# EAGLE design USB to TTL (EAGLE 9.6.2)
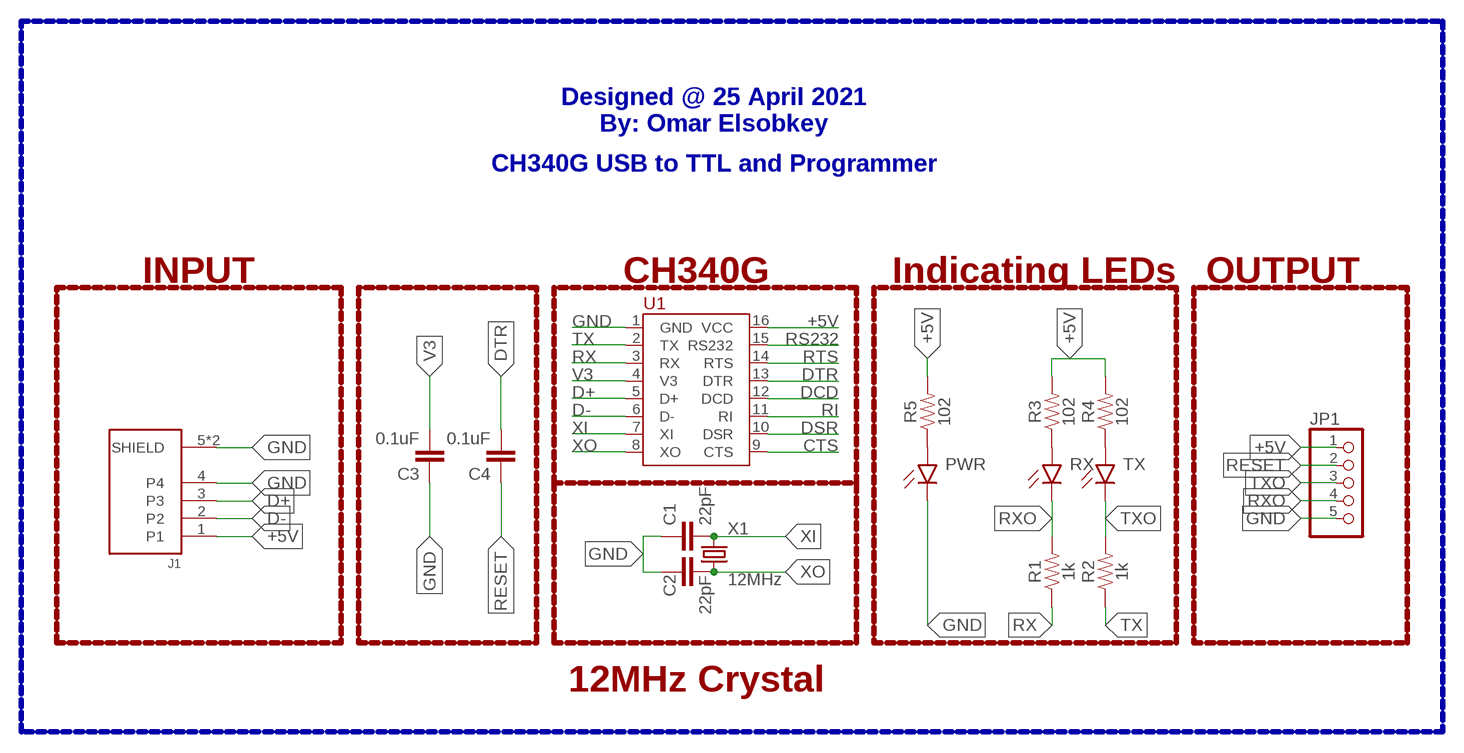
[diagram p0: schematic, sheet 1]

## Parts
C1  22pF  22PF-PTH-2.54MM-200V-5%  [CAP-PTH-2.54]
C2  22pF  22PF-PTH-2.54MM-200V-5%  [CAP-PTH-2.54]
C3  0.1uF  0.1UF-KIT-EZ-50V-20%  [CAP-PTH-SMALL-KIT]
C4  0.1uF  0.1UF-KIT-EZ-50V-20%  [CAP-PTH-SMALL-KIT]
J1  0480371000  [0480371000]
JP1  PINHD-1X5/90  [1X05/90]
PWR  CHIP-FLAT-B_0805  [LEDC2012X110N_FLAT-B]
R1  1k  RESISTOR1206  [1206]
R2  1k  RESISTOR1206  [1206]
R3  102  RESISTOR1206  [1206]
R4  102  RESISTOR1206  [1206]
R5  102  RESISTOR1206  [1206]
RX  CHIP-FLAT-B_0805  [LEDC2012X110N_FLAT-B]
TX  CHIP-FLAT-B_0805  [LEDC2012X110N_FLAT-B]
U1  CH340G  [SOP-16]
X1  12MHz  49S/18PF  [XTAL_HC49]

## Nets
+5V: J1.1 JP1.1 R3.2 R4.2 R5.2 U1.16(VCC)
CTS: U1.9(CTS)
D+: J1.3 U1.5(D+)
D-: J1.2 U1.6(D-)
DCD: U1.12(DCD)
DSR: U1.10(DSR)
DTR: C4.2 U1.13(DTR)
GND: C1.1 C2.1 C3.1 J1.4 J1.5(SHIELD) J1.6(SHIELD) JP1.5 PWR.C U1.1(GND)
N$1: R3.1 RX.A
N$2: R4.1 TX.A
N$3: PWR.A R5.1
RESET: C4.1 JP1.2
RI: U1.11(RI)
RS232: U1.15(RS232)
RTS: U1.14(RTS)
RX: R1.1 U1.3(RX)
RXO: JP1.4 R1.2 RX.C
TX: R2.1 U1.2(TX)
TXO: JP1.3 R2.2 TX.C
V3: C3.2 U1.4(V3)
XI: C1.2 U1.7(XI) X1.2
XO: C2.2 U1.8(XO) X1.1

## Buses
B$1

## Notes on the sheet
- Designed @ 25 April 2021
  By: Omar Elsobkey
- CH340G USB to TTL and Programmer
- INPUT | CH340G | Indicating LEDs | OUTPUT
- 12MHz Crystal

## Library data of the parts
C1 C2 = SparkFun-Capacitors:22PF: 22pF ceramic capacitors A capacitor is a passive two-terminal electrical component used to store electrical energy temporarily in an electric field.; PROD_ID: CAP-09128
C3 C4 = SparkFun-Capacitors:0.1UF: 0.1µF ceramic capacitors A capacitor is a passive two-terminal electrical component used to store electrical energy temporarily in an electric field.; PROD_ID: CAP-08370
J1 = Connectors:0480371000: CONN PLUG USB2.0 TYPEA 4P SMD RA Manufacturer's datasheet <https://www.molex.com/pdm_docs/sd/480371000_sd.pdf>; CREATED_BY: PCBLayout.com; DIGIKEY_PART_NUMBER: WM17118-ND; MANUFACTURER: Molex; MPN: 0480371000
JP1 = pinhead:PINHD-1X5: PIN HEADER
PWR RX TX = LED:CHIP-FLAT-B; CATEGORY: LED; COLOR: BLUE; DESCRIPTION: CHIP LED FLAT; SUB-CATEGORY: CHIP; TYPE: FLAT_TOP; VALUE: LED_BLUE
R1-R5 = SparkFun-Resistors:RESISTOR: Generic Resistor Package
U1 = CH340G:CH340G
X1 = Crystals_Oscillators:49S/18PF: Crystal Manufacturer's datasheet <https://datasheet.octopart.com/49S-18PF-Xinhunjing-datasheet-30677139.pdf>; CREATED_BY: PCBLayout.com; MANUFACTURER: Xinhunjing; MPN: 49S/18PF; PACKAGE: SMD

## Board
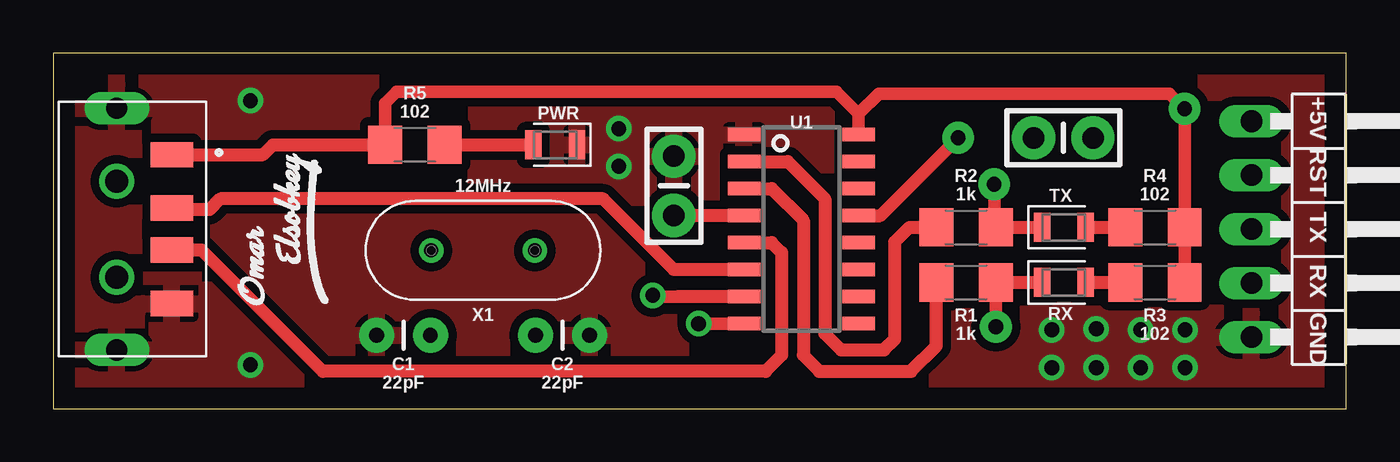
[diagram p1: board, top side]
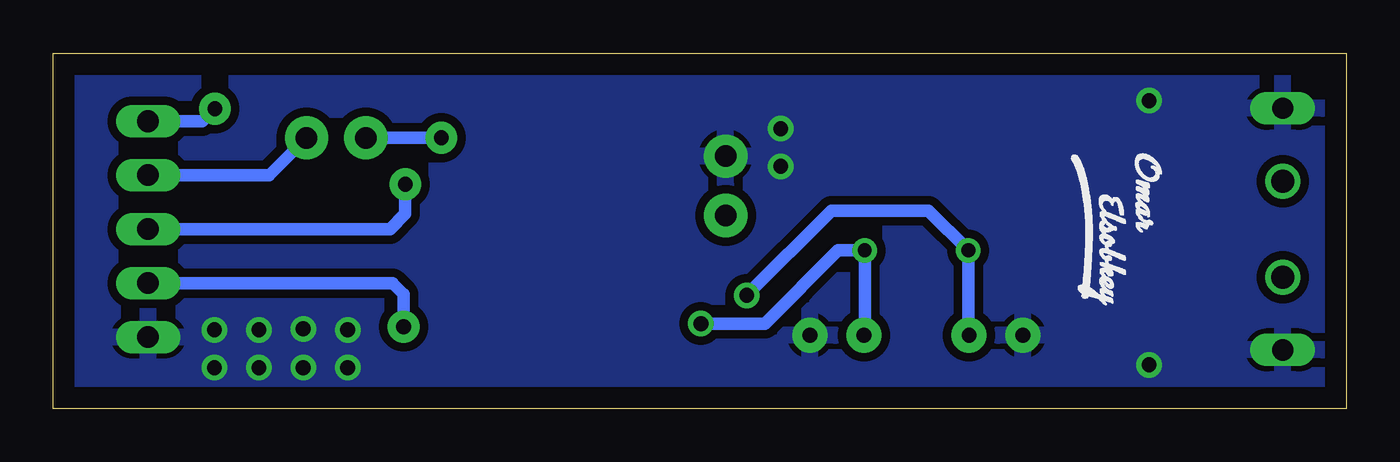
[diagram p2: board, bottom side, seen from below]

Size 60.91 x 16.74 mm. Coordinates in mm from the lower left corner, seen from the top.
Outline: 0,0 60.91,0 60.91,16.74 0,16.74 0,0
Copper layers (1*16): Top 0.035mm / dielectric 1.5mm / Bottom 0.035mm
Design rules "default *": minimum track width 0.3mm, minimum drill 0.4mm, track to track 0.3mm, track to pad 0.3mm, pad to pad 0.3mm, via to via 0.3mm, smd to smd 0.3mm, copper to edge 40mil, drill to drill 6mil, minimum pad ring 10mil, minimum via ring 8mil, stop-mask expansion 4mil, vias tented up to drill 0mil, thermal gap 10mil

### Footprints (pad centres in the part's own frame; a part is rotated, then mirrored left to right if it is on the bottom)
CAP-PTH-2.54 = drill 0.7 pad 1.651: 1 -1.27,0; 2 1.27,0
CAP-PTH-SMALL-KIT = drill 1.016 pad 2.032: 1 -1.397,0; 2 1.397,0
0480371000 = smd 1.194 x 2.007: 1 3.505,-2.591; 2 0.991,-2.591; 3 -0.991,-2.591; 4 -3.505,-2.591 | drill 0.991 pad 1.524 long: 5 5.69,0; 6 -5.69,0 | drill 1.092 pad 1.092: 7 -2.261,0; 8 2.261,0
1X05/90 = drill 1.016 long: 1 -5.08,-3.81; 2 -2.54,-3.81; 3 0,-3.81; 4 2.54,-3.81; 5 5.08,-3.81
LEDC2012X110N_FLAT-B = smd 0.762 x 1.362: A 1.025,0; C -1.025,0
1206 = smd 1.6 x 1.8: 1 -1.4,0; 2 1.4,0
SOP-16 = smd 0.635 x 1.524: 1 -4.445,-2.695; 2 -3.175,-2.695; 3 -1.905,-2.695; 4 -0.635,-2.695; 5 0.635,-2.695; 6 1.905,-2.695; 7 3.175,-2.695; 8 4.445,-2.695; 9 4.445,2.695; 10 3.175,2.695; 11 1.905,2.695; 12 0.635,2.695; 13 -0.635,2.695; 14 -1.905,2.695; 15 -3.175,2.695; 16 -4.445,2.695
XTAL_HC49 = drill 0.65 pad 1.05: 1 -2.44,0; 2 2.44,0

### Placement (x,y rotation side)
C1  16.5,3.45 0 top
C2  23.99,3.45 180 top
C3  29.24,10.49 270 top
C4  47.58,12.75 180 top
J1  3,8.45 90 top
JP1  60.25,8.45 270 top
PWR  23.65,12.42 180 top
R1  43,5.94 0 top
R2  43,8.53 0 top
R3  51.89,5.94 0 top
R4  51.89,8.53 0 top
R5  17.04,12.42 180 top
RX  47.6,5.94 0 top
TX  47.6,8.53 0 top
U1  35.25,8.45 270 top
U$1  [OMAR_ELSOBKEY_X0.5_TN]  11.02,8.1 90 top
U$2  [OMAR_ELSOBKEY_X0.5_TN]  11.02,8.79 270 bottom
X1  20.25,7.45 180 top

### Tracks (layer width: path | path; a pad name or v marks a point on that pad's centre or on a via)
+5V  (via drill 0.7 pad 1.5)
  Top 0.6: R5.2 15.64,14.37 16.18,14.91 36.91,14.91 37.94,13.87 | 37.94,13.87 U1.16 | 37.94,13.87 38.9,14.83 52.58,14.83 v53.29,14.12 R4.2 R3.2
  Top 0.61: R5.2 10.36,12.42 9.89,11.96 J1.1
  Bottom 0.6: JP1.1 53.88,13.53 v53.29,14.12
D+
  Top 0.61: U1.5 33.84,7.82 34.31,7.34 34.31,2.52 33.55,1.75 12.7,1.75 6.99,7.46 J1.3
D-
  Top 0.61: U1.6 29.24,6.55 25.91,9.88 7.87,9.88 7.37,9.37 5.66,9.37 J1.2
DTR  (via drill 0.7 pad 1.5)
  Top 0.61: U1.13 38.96,9.09 v42.63,12.75
  Bottom 0.6: C4.2 v42.63,12.75
GND  (via drill 0.7 pad 1.2)
  other vias: 47.04,3.71 47.04,1.93 49.13,1.93 51.22,1.93 53.31,1.93 53.31,3.71 51.22,3.71 49.13,3.76 9.3,14.5 26.64,13.18 26.64,11.4 9.3,2.06
  pour Top (isolate 0.4): -1.6,24.31 74.93,24.31 74.93,-2.39 -1.6,-2.39
  pour Bottom (isolate 0.4): -3.45,25.7 76.2,25.7 76.2,-3.45 -3.45,-3.45
N$1
  Top 0.61: RX.A R3.1
N$2
  Top 0.61: TX.A R4.1
N$3
  Top 0.61: R5.1 PWR.A
RESET
  Bottom 0.6: C4.1 50.74,10.99 JP1.2
RX
  Top 0.61: U1.3 33.84,10.36 35.33,8.87 35.33,2.52 36.09,1.75 40.41,1.75 41.6,2.94 R1.1
RXO  (via drill 0.7 pad 1.5)
  Top 0.6: R1.2 v44.4,3.86
  Top 0.61: R1.2 RX.C
  Bottom 0.6: v44.4,3.86 44.4,5.38 44.92,5.91 JP1.4
TX
  Top 0.61: U1.2 34.6,11.63 36.35,9.88 36.35,3.53 37.11,2.77 39.14,2.77 39.65,3.28 39.65,7.85 40.34,8.53 R2.1
TXO  (via drill 0.7 pad 1.5)
  Top 0.6: R2.2 44.32,8.61 v44.32,10.57
  Top 0.61: R2.2 TX.C
  Bottom 0.6: v44.32,10.57 44.32,9.17 45.04,8.45 JP1.3
V3
  Top 0.61: C3.2 U1.4
XI  (via drill 0.7 pad 1.2)
  Top 0.6: 29.9,5.28 28.3,5.28 v28.25,5.33
  Top 0.61: U1.7 29.9,5.28 29.42,5.28
  Bottom 0.6: C1.2 17.81,3.49 X1.2 19.68,9.32 24.26,9.32 v28.25,5.33
XO  (via drill 0.7 pad 1.2)
  Top 0.6: U1.8 32.54,4 v30.4,4
  Bottom 0.6: C2.2 22.69,3.49 X1.1 23.94,7.45 27.39,4 v30.4,4

### Text on the board
tNames: +5V RST TX RX GND